# EAGLE design schematic (EAGLE 8.3.2)
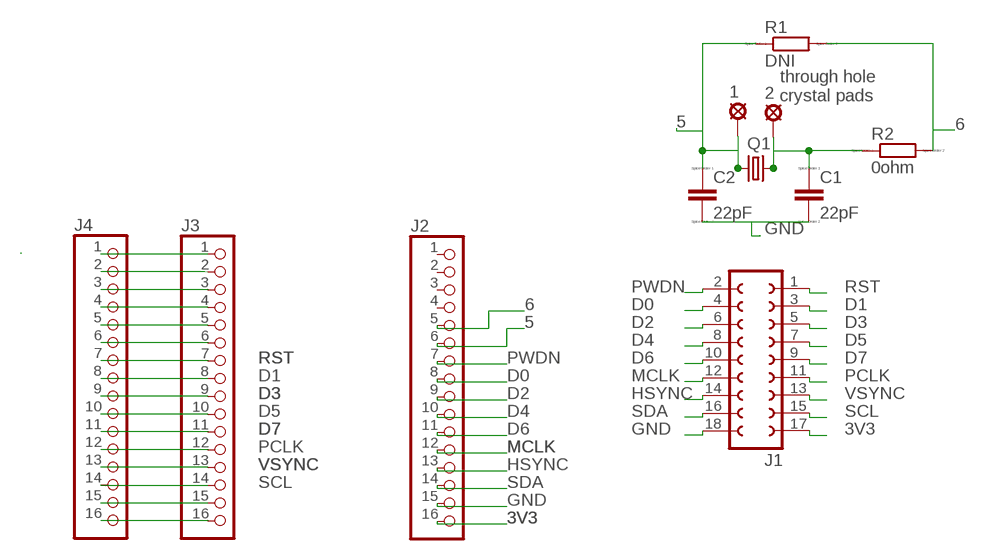
[diagram p0: schematic, sheet 1]

## Parts
1  LSP10  [LSP10]
2  LSP10  [LSP10]
C1  22pF  CC0603  [C0603]
C2  22pF  CC0603  [C0603]
J1  FE09-2  [FE09-2]
J2  PINHD-1X16  [1X16]
J3  PINHD-1X16  [1X16]
J4  PINHD-1X16  [1X16]
Q1  CRYSTALHC49UP  [HC49UP]
R1  DNI  RR0603  [R0603]
R2  0ohm  RR0603  [R0603]

## Nets
3V3: J1.17 J2.16
5: 1.MP C2.1 J2.6 Q1.1 R1.1
6: J2.5 R1.2 R2.2
D0: J1.4 J2.8
D1: J1.3 J3.8 J4.8
D2: J1.6 J2.9
D3: J1.5 J3.9 J4.9
D4: J1.8 J2.10
D5: J1.7 J3.10 J4.10
D6: J1.10 J2.11
D7: J1.9 J3.11 J4.11
GND: C1.2 C2.2 J1.18 J2.15
HSYNC: J1.14 J2.13
MCLK: J1.12 J2.12
N$1: J3.1 J4.1
N$2: J3.2 J4.2
N$3: J3.3 J4.3
N$4: J3.5 J4.5
N$5: J3.6 J4.6
N$6: J3.4 J4.4
N$7: 2.MP C1.1 Q1.2 R2.1
N$15: J3.15 J4.15
N$16: J3.16 J4.16
PCLK: J1.11 J3.12 J4.12
PWDN: J1.2 J2.7
RST: J1.1 J3.7 J4.7
SCL: J1.15 J3.14 J4.14
SDA: J1.16 J2.14
VSYNC: J1.13 J3.13 J4.13
Unconnected: J2.1 J2.2 J2.3 J2.4

## Notes on the sheet
- through hole
   crystal pads

## Library data of the parts
1 2 = solpad:LSP10: SOLDER PAD drill 1.0 mm, distributor Buerklin, 12H555
C1 C2 = eagle-ltspice:C: CAPACITOR, European symbol; SPICEMODEL: NONE; SPICEPREFIX: C
J1 = con-lsta:FE09-2: FEMALE HEADER; OC_FARNELL: unknown; OC_NEWARK: unknown
J2-J4 = pinhead:PINHD-1X16: PIN HEADER
Q1 = crystal:CRYSTAL: CRYSTAL; OC_FARNELL: unknown; OC_NEWARK: unknown
R1 R2 = eagle-ltspice:R: RESISTOR, European symbol; SPICEMODEL: NONE; SPICEPREFIX: R

## Board
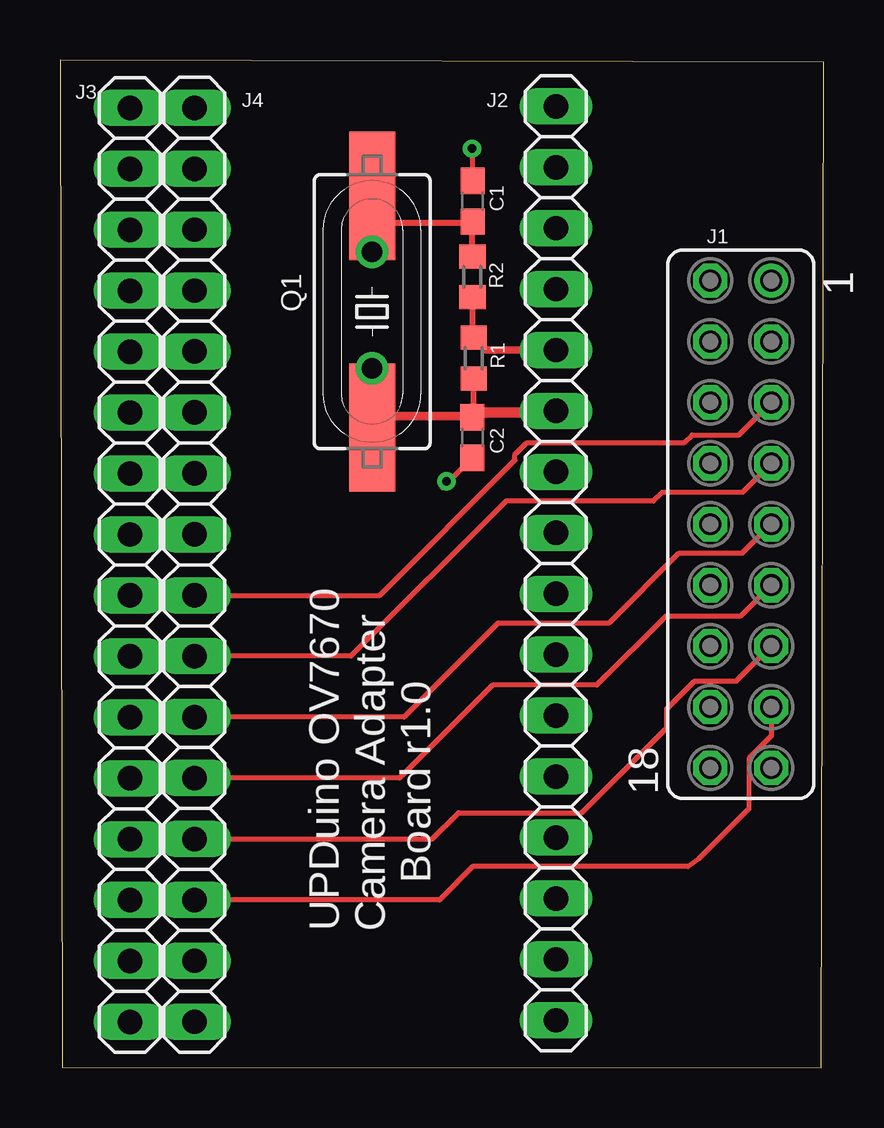
[diagram p1: board, top side]
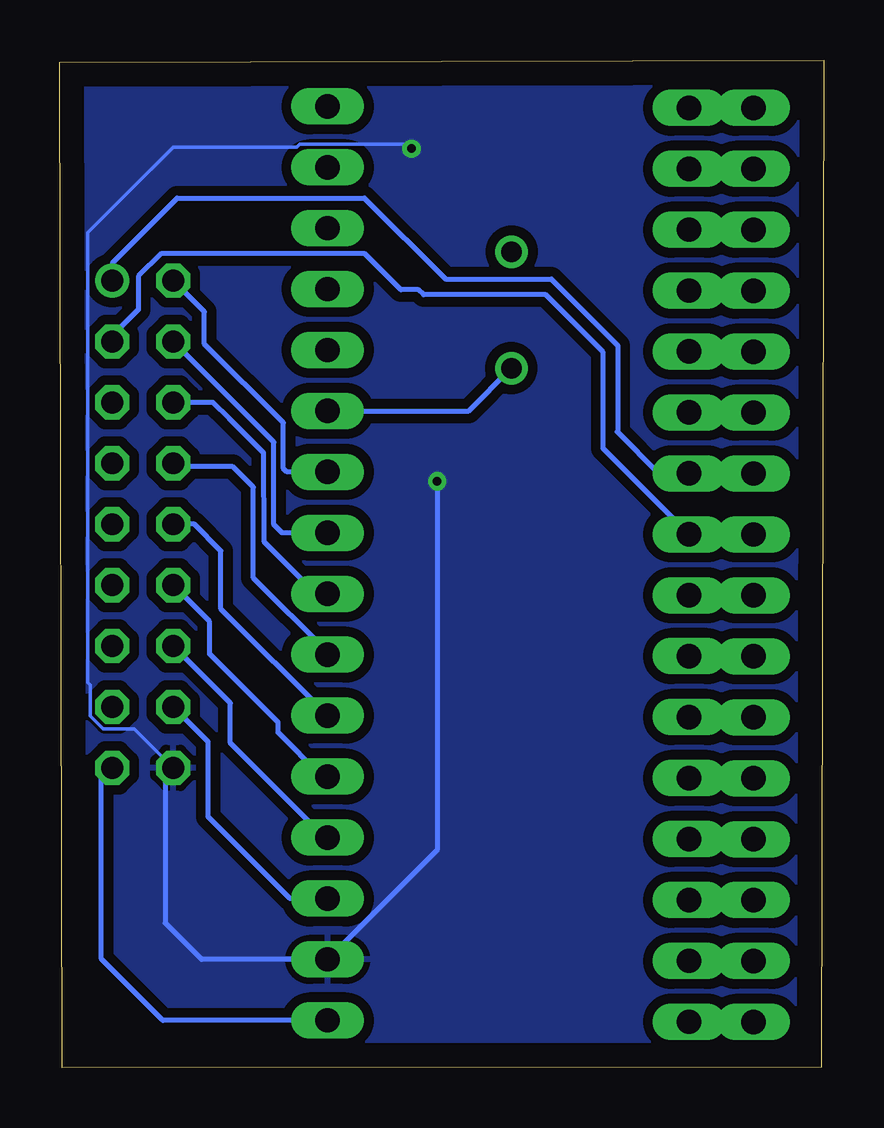
[diagram p2: board, bottom side, seen from below]

Size 31.81 x 42.02 mm. Coordinates in mm from the lower left corner, seen from the top.
Outline: 0.1,0.02 31.71,0 31.81,41.93 0,42.02 0.1,0.02
Copper layers (1*16): Top 0.035mm / dielectric 1.5mm / Bottom 0.035mm
Design rules "default *": minimum track width 5mil, minimum drill 12mil, track to track 5mil, track to pad 5mil, pad to pad 5mil, via to via 5mil, smd to smd 5mil, copper to edge 40mil, drill to drill 6mil, minimum pad ring 10mil, minimum via ring 8mil, stop-mask expansion 4mil, vias tented up to drill 0mil, thermal gap 10mil

### Footprints (pad centres in the part's own frame; a part is rotated, then mirrored left to right if it is on the bottom)
LSP10 = drill 0.85: MP 0,0
C0603 = smd 1.1 x 1: 1 -0.85,0; 2 0.85,0
FE09-2 = drill 0.914: 1 -10.16,1.27 | drill 0.914 octagon: 2 -10.16,-1.27; 3 -7.62,1.27; 4 -7.62,-1.27; 5 -5.08,1.27; 6 -5.08,-1.27; 7 -2.54,1.27; 8 -2.54,-1.27; 9 0,1.27; 10 0,-1.27; 11 2.54,1.27; 12 2.54,-1.27; 13 5.08,1.27; 14 5.08,-1.27; 15 7.62,1.27; 16 7.62,-1.27; 17 10.16,1.27; 18 10.16,-1.27
1X16 = drill 1.016 long: 1 -19.05,0; 2 -16.51,0; 3 -13.97,0; 4 -11.43,0; 5 -8.89,0; 6 -6.35,0; 7 -3.81,0; 8 -1.27,0; 9 1.27,0; 10 3.81,0; 11 6.35,0; 12 8.89,0; 13 11.43,0; 14 13.97,0; 15 16.51,0; 16 19.05,0
HC49UP = smd 5.334 x 1.93: 1 -4.826,0; 2 4.826,0
R0603 = smd 1 x 1.1: 1 -0.85,0; 2 0.85,0

### Placement (x,y rotation side)
1  13.01,29.17 0 top
2  13,34.02 0 top
C1  17.19,36.13 90 top
C2  17.18,26.28 270 top
J1  28.37,22.67 270 top
J2  20.66,21.04 270 top
J3  2.92,20.97 270 top
J4  5.6,20.97 270 top
Q1  13.01,31.53 90 top
R1  17.24,29.59 90 top
R2  17.18,32.98 270 top

### Tracks (layer width: path | path; a pad name or v marks a point on that pad's centre or on a via)
3V3
  Bottom 0.203: J2.16 27.53,1.99 30.09,4.55 30.09,12.05 J1.17
5
  Top 0.2: 13.01,28.92 13.01,27.22 Q1.1 | 13.01,28.92 1.MP | 13.19,28.74 13.01,28.92
  Top 0.254: C2.1 17.09,27.22 16.84,27.22 | 16.84,27.22 13.01,27.22 | Q1.1 13.44,27.13 C2.1 | C2.1 17.24,27.18 17.24,27.41 | 17.24,27.41 R1.1 | 17.24,27.41 20.64,27.41 J2.6 20.49,27.22 16.84,27.22
  Bottom 0.2: J2.6 14.79,27.39 1.MP
6
  Top 0.2: 17.18,30.69 17.18,30.5 R1.2
  Top 0.254: 17.18,31.75 17.18,30.69 | 20.51,29.93 J2.5
  Top 0.305: R1.2 17.76,29.93 20.51,29.93 | R2.2 17.18,31.75
D0
  Bottom 0.2: J2.8 22.56,22.31 22.9,22.65 22.9,26.09 J1.4
D1
  Bottom 0.2: J1.3 29.64,30.52 28.55,31.61 28.55,33 27.6,33.94 19.11,33.94 17.61,32.44 16.88,32.44 16.67,32.23 11.57,32.23 9.18,29.84 9.18,25.82 J4.8
  Bottom 0.203: J3.8 J4.8
D2
  Bottom 0.2: J2.9 21.14,19.77 23.29,21.92 23.33,25.64 24.76,27.06 25.44,27.74 J1.6
D3
  Top 0.2: J4.9 13.32,19.7 18.95,25.33 18.95,25.56 19.45,26.06 26,26.06 26.33,26.39 28.28,26.39 J1.5
  Bottom 0.203: J3.9 J4.9
D4
  Bottom 0.2: J2.10 20.66,17.34 23.76,20.43 23.76,24.21 24.62,25.07 26.96,25.07 J1.8
D5
  Top 0.2: J1.7 28.43,24 25.09,24 24.72,23.63 18.58,23.63 12.12,17.16 J4.10
  Bottom 0.203: J3.10 J4.10
D6
  Bottom 0.2: J2.11 25.12,19.14 25.12,21.56 26.22,22.66 J1.10
D7
  Top 0.2: J1.9 28.43,21.46 25.79,21.46 22.88,18.55 18.26,18.55 14.34,14.62 J4.11
  Bottom 0.203: J3.11 J4.11
GND  (via drill 0.35)
  Top 0.152: 15.94,24.19 v16.1,24.45 | 17.19,38.3 v17.17,38.32
  Top 0.2: C2.2 15.94,24.19 | C1.2 17.19,38.3
  Bottom 0.152: J1.18 28.72,14.13 30.02,14.13 30.55,14.67 30.55,15.96 30.66,16.07 30.66,17.45 30.66,34.82 27.09,38.39 21.94,38.39 21.82,38.51 17.36,38.51 v17.17,38.32
  Bottom 0.2: v16.1,24.45 16.1,9.09 J2.15
  Bottom 0.203: J2.15 25.92,4.53 27.43,6.04 27.43,12.17 J1.18
  pour Bottom (isolate 0.406): 0.25,0.18 0.25,0.14 31.56,0.14 31.56,41.69 31.32,41.69 31.32,41.69 30.94,41.69 0.23,41.69 0.23,0.19
HSYNC
  Bottom 0.2: J2.13 20.78,9.61 24.72,13.55 24.72,15.21 J1.14
MCLK
  Bottom 0.2: J2.12 20.9,12.15 22.73,13.98 22.73,14.41 25.58,17.26 25.58,18.61 J1.12
N$1
  Bottom 0.203: J3.1 J4.1
N$2
  Bottom 0.203: J3.2 J4.2
N$3
  Bottom 0.203: J3.3 J4.3
N$4
  Bottom 0.203: J3.5 J4.5
N$5
  Bottom 0.203: J3.6 J4.6
N$6
  Bottom 0.203: J3.4 J4.4
N$7
  Top 0.2: 17.18,35.08 C1.1
  Top 0.254: 13,36.34 Q1.2 13,36.34 | 13,35.22 13,36.34 | 13,35.22 2.MP 13,36.34 | R2.1 17.18,35.08 | C1.1 17.13,35.22 13,35.22
N$15
  Bottom 0.203: J3.15 J4.15
N$16
  Bottom 0.203: J3.16 J4.16
PCLK
  Top 0.2: J1.11 28.34,18.83 25.23,18.83 22.37,15.96 18.03,15.96 14.15,12.08 J4.12
  Bottom 0.203: J3.12 J4.12
PWDN
  Bottom 0.2: J2.7 22.36,24.85 22.51,24.99 22.51,26.9 25.8,30.18 25.8,31.52 J1.2
RST
  Bottom 0.2: J1.1 29.64,33.56 26.93,36.27 19.13,36.27 15.75,32.88 11.34,32.88 8.57,30.11 8.57,26.56 8.61,26.52 6.87,24.78 J4.7
  Bottom 0.203: J3.7 J4.7
SCL
  Top 0.2: J1.15 29.64,13.83 28.7,12.89 28.7,10.8 26.62,8.72 26.18,8.39 17.2,8.39 15.81,7 J4.14
  Bottom 0.203: J3.14 J4.14
SDA
  Bottom 0.2: J2.14 22.24,7.07 25.65,10.47 25.65,13.59 J1.16
VSYNC
  Top 0.2: J4.13 15.51,9.54 16.61,10.64 21.74,10.64 25.28,14.18 25.28,14.97 26.44,16.13 28.18,16.13 J1.13
  Bottom 0.203: J3.13 J4.13

### Text on the board
tNames: UPDuino OV7670 / Camera Adapter / Board r1.0